# Altium schematic sheet Lock.SchDoc
size A4
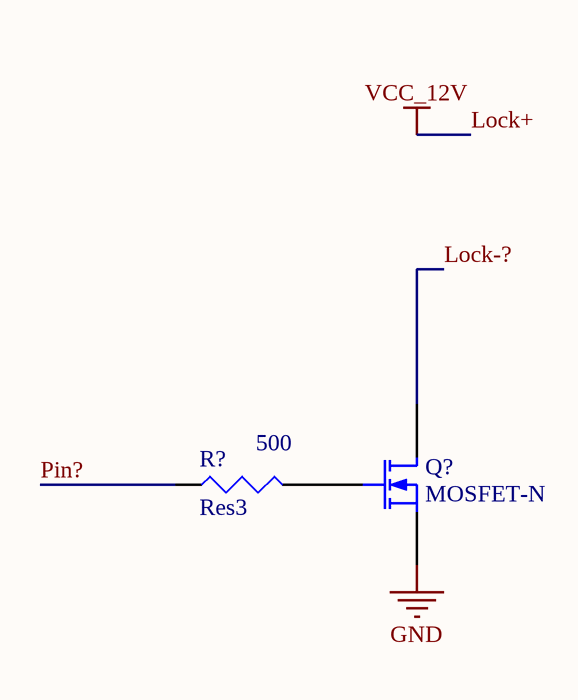
[diagram p0: Lock.SchDoc]

## Parts
Q?  MOSFET-N  [E3]
R?  Res3  value 500  [J1-0603]

## Nets
GND: Q?.3(S)
Lock-?: Q?.1(D)
Pin?: R?.1
NetQ?_2: Q?.2(G) R?.2

## Library data of the parts
Q? = MOSFET-N: N-Channel MOSFET; Published: 8-Jun-2000; LatestRevisionDate: 17-Jul-2002; LatestRevisionNote: Re-released for DXP Platform.; PackageVersion: 1995/1996; PackageReference: E3; Publisher: Altium Limited; PackageDescription: TO, Flat Index; 3 In-Line, Axial Leads; Body Dia. 4.6mm; Lead Dia. 0.5 mm (max)
R? = Res3: Resistor; Published: 8-Jun-2000; LatestRevisionDate: 29-May-2009; LatestRevisionNote: IPC-7351 Footprint Added.; PackageReference: J1-0603; Publisher: Altium Limited; PackageDescription: Chip Resistor